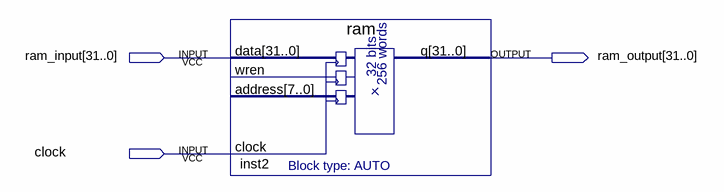
[diagram p0: schematic sheet]
// Quartus schematic ram.bdf as structural Verilog: 1 symbols, 3 pins
module ram (
  input  [31:0] ram_input,
  input  clock,
  output [31:0] ram_output
);

  ram inst2 (.data(ram_input), .clock(clock), .q(ram_output));  // open: wren, address
endmodule
